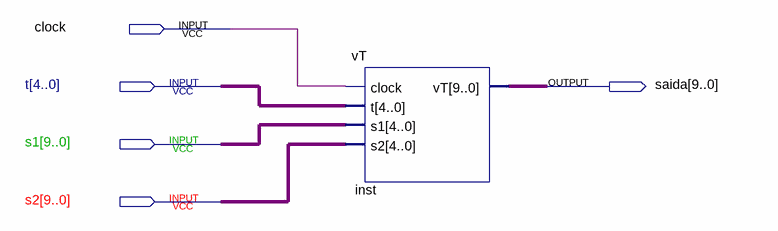
[diagram p0: schematic sheet]
// Quartus schematic main.bdf as structural Verilog: 1 symbols, 5 pins
module main (
  input  clock,
  input  [4:0] t,
  input  [9:0] s1,
  input  [9:0] s2,
  output [9:0] saida
);

  vT inst (.clock(clock), .t(t), .s1(s1), .s2(s2), .vT(saida));
endmodule
